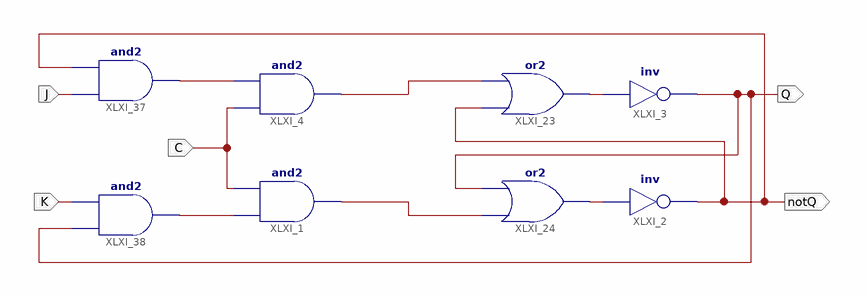
[diagram p0: schematic sheet 1]
// Xilinx ISE schematic Schem2.sch (virtex5) as structural Verilog: 8 symbols, 5 ports
module Schem2 (
  input  C,
  input  J,
  input  K,
  output notQ,
  output Q
);

  wire XLXN_76, XLXN_79, XLXN_108, XLXN_109, XLXN_114, XLXN_115;

  not XLXI_3 (Q, XLXN_108);
  not XLXI_2 (notQ, XLXN_109);
  or XLXI_23 (XLXN_108, notQ, XLXN_114);
  or XLXI_24 (XLXN_109, XLXN_115, Q);
  and XLXI_4 (XLXN_114, C, XLXN_76);
  and XLXI_1 (XLXN_115, XLXN_79, C);
  and XLXI_37 (XLXN_76, J, notQ);
  and XLXI_38 (XLXN_79, Q, K);
endmodule
